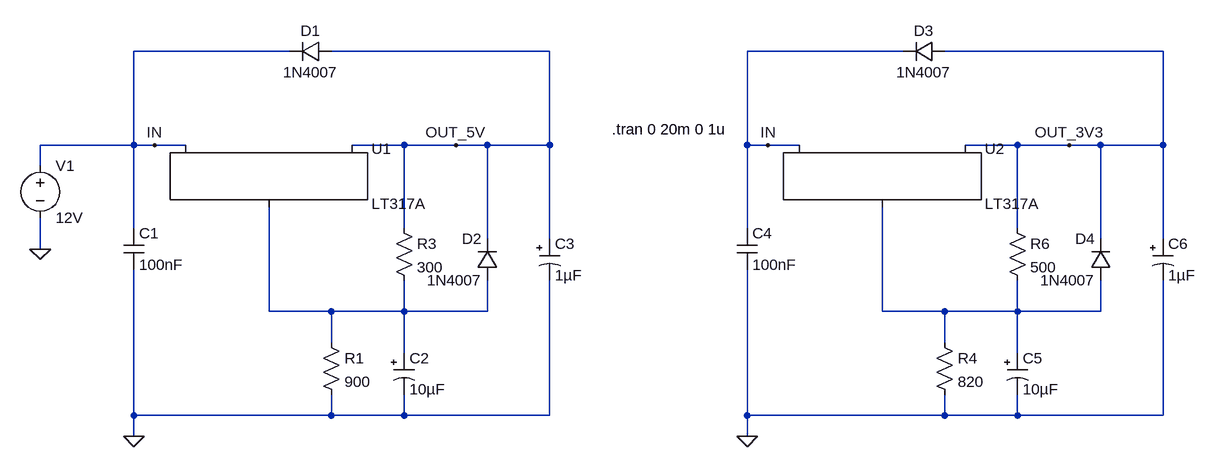
[diagram p0: schematic supply.asc]
supply.asc, the LTspice schematic file:
Version 4
SHEET 1 1764 680
WIRE 128 -160 -112 -160
WIRE 528 -160 192 -160
WIRE 1072 -160 832 -160
WIRE 1472 -160 1136 -160
WIRE -112 -16 -112 -160
WIRE -112 -16 -256 -16
WIRE -80 -16 -112 -16
WIRE -32 -16 -80 -16
WIRE 304 -16 224 -16
WIRE 384 -16 304 -16
WIRE 432 -16 384 -16
WIRE 528 -16 528 -160
WIRE 528 -16 432 -16
WIRE 832 -16 832 -160
WIRE 864 -16 832 -16
WIRE 912 -16 864 -16
WIRE 1248 -16 1168 -16
WIRE 1328 -16 1248 -16
WIRE 1376 -16 1328 -16
WIRE 1472 -16 1472 -160
WIRE 1472 -16 1376 -16
WIRE -256 16 -256 -16
WIRE -112 112 -112 -16
WIRE 304 112 304 -16
WIRE 832 112 832 -16
WIRE 1248 112 1248 -16
WIRE 432 128 432 -16
WIRE 528 128 528 -16
WIRE 1376 128 1376 -16
WIRE 1472 128 1472 -16
WIRE -256 144 -256 96
WIRE 96 240 96 80
WIRE 192 240 96 240
WIRE 304 240 304 192
WIRE 304 240 192 240
WIRE 432 240 432 192
WIRE 432 240 304 240
WIRE 1040 240 1040 80
WIRE 1136 240 1040 240
WIRE 1248 240 1248 192
WIRE 1248 240 1136 240
WIRE 1376 240 1376 192
WIRE 1376 240 1248 240
WIRE 192 288 192 240
WIRE 1136 288 1136 240
WIRE 304 304 304 240
WIRE 1248 304 1248 240
WIRE -112 400 -112 176
WIRE 192 400 192 368
WIRE 192 400 -112 400
WIRE 304 400 304 368
WIRE 304 400 192 400
WIRE 528 400 528 192
WIRE 528 400 304 400
WIRE 832 400 832 176
WIRE 1136 400 1136 368
WIRE 1136 400 832 400
WIRE 1248 400 1248 368
WIRE 1248 400 1136 400
WIRE 1472 400 1472 192
WIRE 1472 400 1248 400
WIRE -112 432 -112 400
WIRE 832 432 832 400
FLAG -112 432 0
FLAG -80 -16 IN
FLAG 384 -16 OUT_5V
FLAG -256 144 0
FLAG 832 432 0
FLAG 864 -16 IN
FLAG 1328 -16 OUT_3V3
SYMBOL PowerProducts\\LT317A 96 -16 R0
SYMATTR InstName U1
SYMBOL diode 192 -176 R90
WINDOW 0 0 32 VBottom 2
WINDOW 3 32 32 VTop 2
SYMATTR InstName D1
SYMATTR Value 1N4007
SYMBOL diode 448 192 R180
WINDOW 0 24 64 Left 2
WINDOW 3 24 0 Left 2
SYMATTR InstName D2
SYMATTR Value 1N4007
SYMBOL cap -128 112 R0
SYMATTR InstName C1
SYMATTR Value 100nF
SYMBOL polcap 288 304 R0
SYMATTR InstName C2
SYMATTR Value 10µF
SYMBOL res 176 272 R0
SYMATTR InstName R1
SYMATTR Value 900
SYMBOL res 288 96 R0
SYMATTR InstName R3
SYMATTR Value 300
SYMBOL polcap 512 128 R0
SYMATTR InstName C3
SYMATTR Value 1µF
SYMBOL voltage -256 0 R0
SYMATTR InstName V1
SYMATTR Value 12V
SYMBOL PowerProducts\\LT317A 1040 -16 R0
SYMATTR InstName U2
SYMBOL diode 1136 -176 R90
WINDOW 0 0 32 VBottom 2
WINDOW 3 32 32 VTop 2
SYMATTR InstName D3
SYMATTR Value 1N4007
SYMBOL diode 1392 192 R180
WINDOW 0 24 64 Left 2
WINDOW 3 24 0 Left 2
SYMATTR InstName D4
SYMATTR Value 1N4007
SYMBOL cap 816 112 R0
SYMATTR InstName C4
SYMATTR Value 100nF
SYMBOL polcap 1232 304 R0
SYMATTR InstName C5
SYMATTR Value 10µF
SYMBOL res 1120 272 R0
SYMATTR InstName R4
SYMATTR Value 820
SYMBOL res 1232 96 R0
SYMATTR InstName R6
SYMATTR Value 500
SYMBOL polcap 1456 128 R0
SYMATTR InstName C6
SYMATTR Value 1µF
TEXT 624 -40 Left 2 !.tran 0 20m 0 1u

The netlist it stands for:
* supply.asc
XU1 N001 OUT_5V IN LT317A
D1 OUT_5V IN 1N4007
D2 N001 OUT_5V 1N4007
C1 IN 0 100nF
C2 N001 0 10µF
R1 N001 0 900
R3 OUT_5V N001 300
C3 OUT_5V 0 1µF
V1 IN 0 12V
XU2 N002 OUT_3V3 IN LT317A
D3 OUT_3V3 IN 1N4007
D4 N002 OUT_3V3 1N4007
C4 IN 0 100nF
C5 N002 0 10µF
R4 N002 0 820
R6 OUT_3V3 N002 500
C6 OUT_3V3 0 1µF
.model D D
.lib standard.dio
.tran 0 20m 0 1u
.lib LTC.lib
.backanno
.end